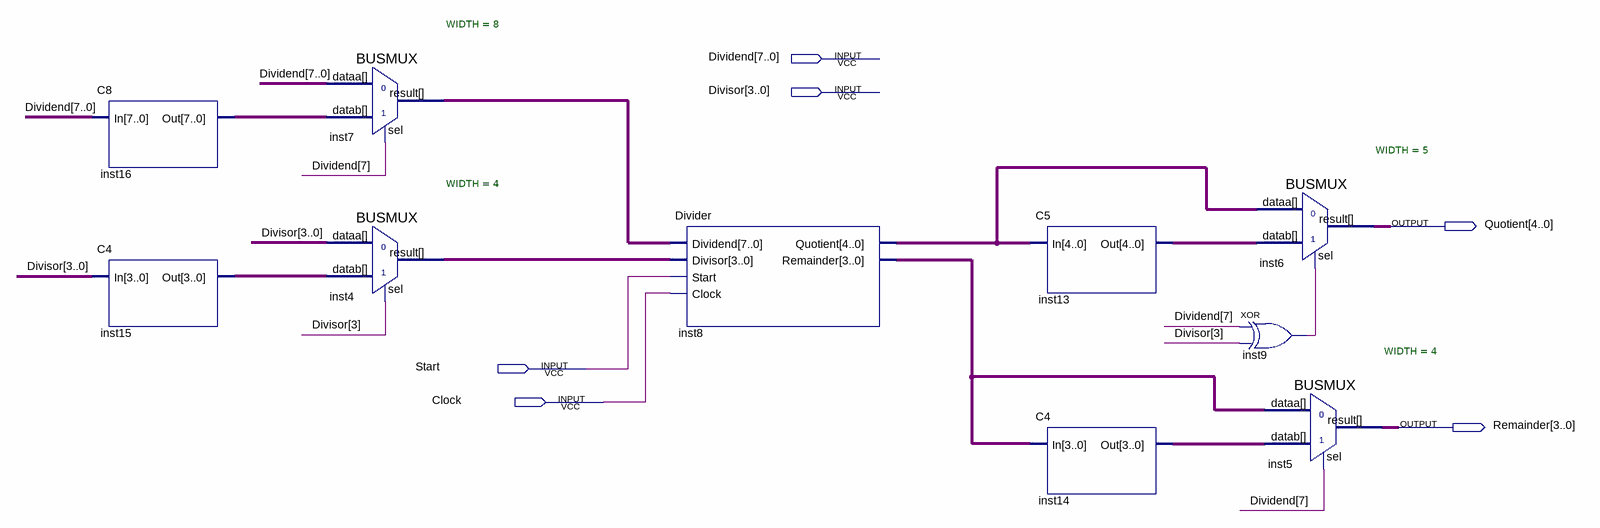
[diagram p0: schematic sheet]
// Quartus schematic S_Divider.bdf as structural Verilog: 10 symbols, 6 pins
module S_Divider (
  input  [7:0] Dividend,
  input  [3:0] Divisor,
  input  Start,
  input  Clock,
  output [4:0] Quotient,
  output [3:0] Remainder
);

  wire inst9_out;
  wire [3:0] inst4_result, inst8_remainder, inst14_out, inst15_out;
  wire [4:0] inst8_quotient, inst13_out;
  wire [7:0] inst7_result, inst16_out;

  C8 inst16 (.In(Dividend), .Out(inst16_out));
  C4 inst15 (.In(Divisor), .Out(inst15_out));
  BUSMUX #(.WIDTH(8)) inst7 (.datab(inst16_out), .sel(Dividend[7]), .dataa(Dividend), .result(inst7_result));
  BUSMUX #(.WIDTH(4)) inst4 (.datab(inst15_out), .sel(Divisor[3]), .dataa(Divisor), .result(inst4_result));
  Divider inst8 (
    .Dividend(inst7_result), .Divisor(inst4_result), .Start(Start), .Clock(Clock), .Quotient(inst8_quotient),
    .Remainder(inst8_remainder));
  C5 inst13 (.In(inst8_quotient), .Out(inst13_out));
  C4 inst14 (.In(inst8_remainder), .Out(inst14_out));
  xor inst9 (inst9_out, Dividend[7], Divisor[3]);
  BUSMUX #(.WIDTH(5)) inst6 (.datab(inst13_out), .sel(inst9_out), .dataa(inst8_quotient), .result(Quotient));
  BUSMUX #(.WIDTH(4)) inst5 (.datab(inst14_out), .sel(Dividend[7]), .dataa(inst8_remainder), .result(Remainder));
endmodule
